# Altium schematic sheet ADC.SchDoc
size A3
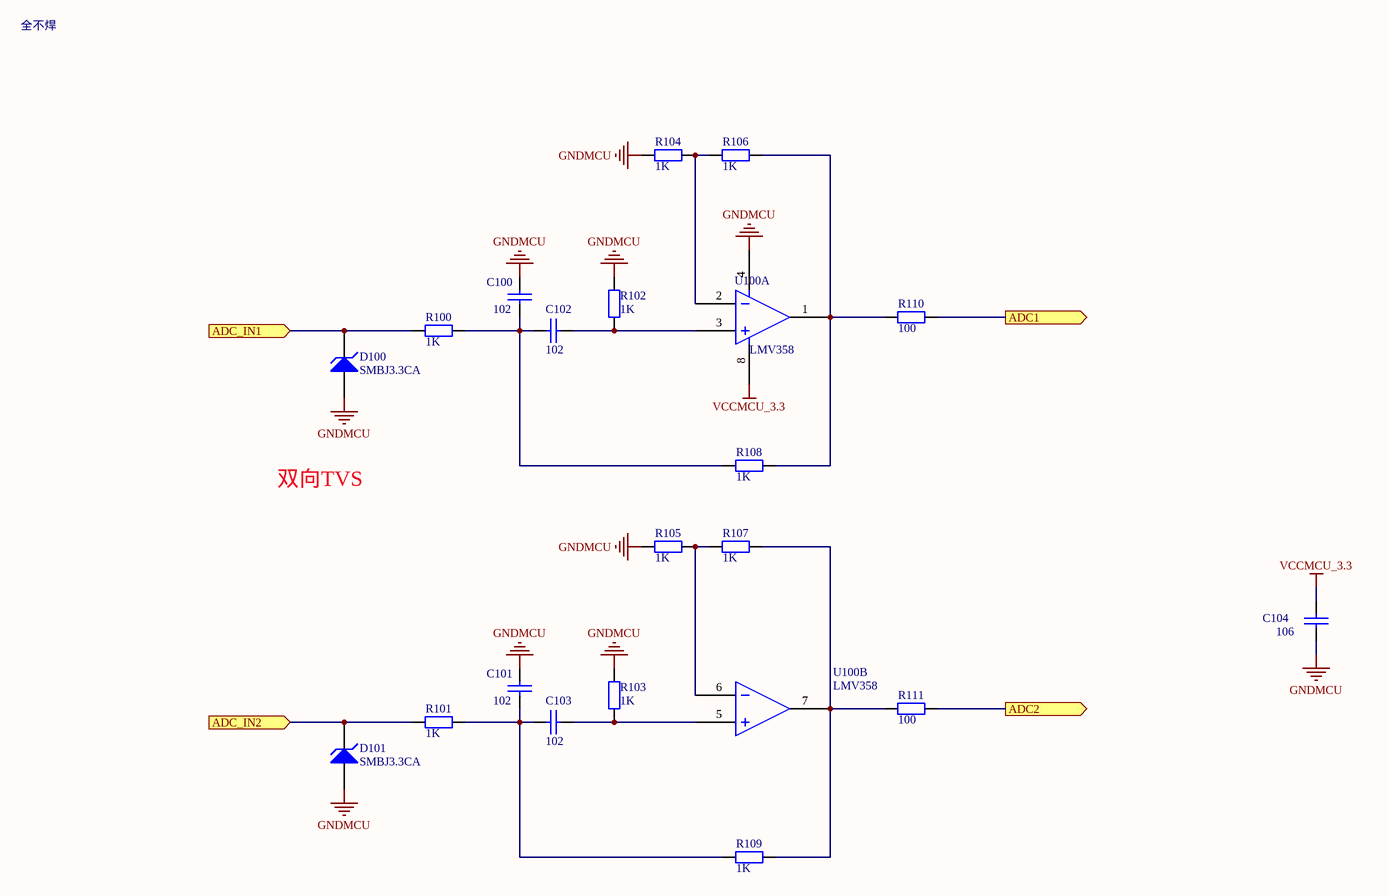
[diagram p0: ADC.SchDoc]

## Parts
C100  102  [0805/C2]
C101  102  [0805/C2]
C102  102  [0805/C2]
C103  102  [0805/C2]
C104  106  [0805/C2]
D100  SMBJ3.3CA  [SMB]
D101  SMBJ3.3CA  [SMB]
R100  1K  [0805/R2]
R101  1K  [0805/R2]
R102  1K  [0805/R2]
R103  1K  [0805/R2]
R104  1K  [0805/R2]
R105  1K  [0805/R2]
R106  1K  [0805/R2]
R107  1K  [0805/R2]
R108  1K  [0805/R2]
R109  1K  [0805/R2]
R110  100  [0805/R2]
R111  100  [0805/R2]
U100  LMV358  [SO-8]  (parts A,B of 2)

## Ports
ADC1 (out), ADC2 (out), ADC_IN1 (in), ADC_IN2 (in)

## Nets
GNDMCU: C100.1 C101.1 C104.2 D100.1(A) D101.1(A) R102.1 R103.1 R104.1 R105.1 U100.4
VCCMCU_3.3: C104.1 U100.8
ADC1: R110.1 ; port ADC1
ADC2: R111.1 ; port ADC2
ADC_IN1: D100.2(K) R100.2 ; port ADC_IN1
ADC_IN2: D101.2(K) R101.2 ; port ADC_IN2
NetC100_2: C100.2 C102.1 R100.1 R108.2
NetC101_2: C101.2 C103.1 R101.1 R109.2
NetC102_2: C102.2 R102.2 U100.3
NetC103_2: C103.2 R103.2 U100.5
NetR104_2: R104.2 R106.2 U100.2
NetR105_2: R105.2 R107.2 U100.6
NetR106_1: R106.1 R108.1 R110.2 U100.1
NetR107_1: R107.1 R109.1 R111.2 U100.7

## Notes on the sheet
- 全不焊
- 双向TVS

## Library data of the parts
C100-C104 = CAP: Capacitor
D100 D101 = D Zener: Zener Diode; Published: 8-Jun-2000; LatestRevisionDate: 17-Jul-2002; LatestRevisionNote: Re-released for DXP Platform.; PackageReference: DIODE-0.7; Publisher: Altium Limited
R100-R111 = RES1
U100 = 1458